# EAGLE design datalogger1 (EAGLE 7.4.0)
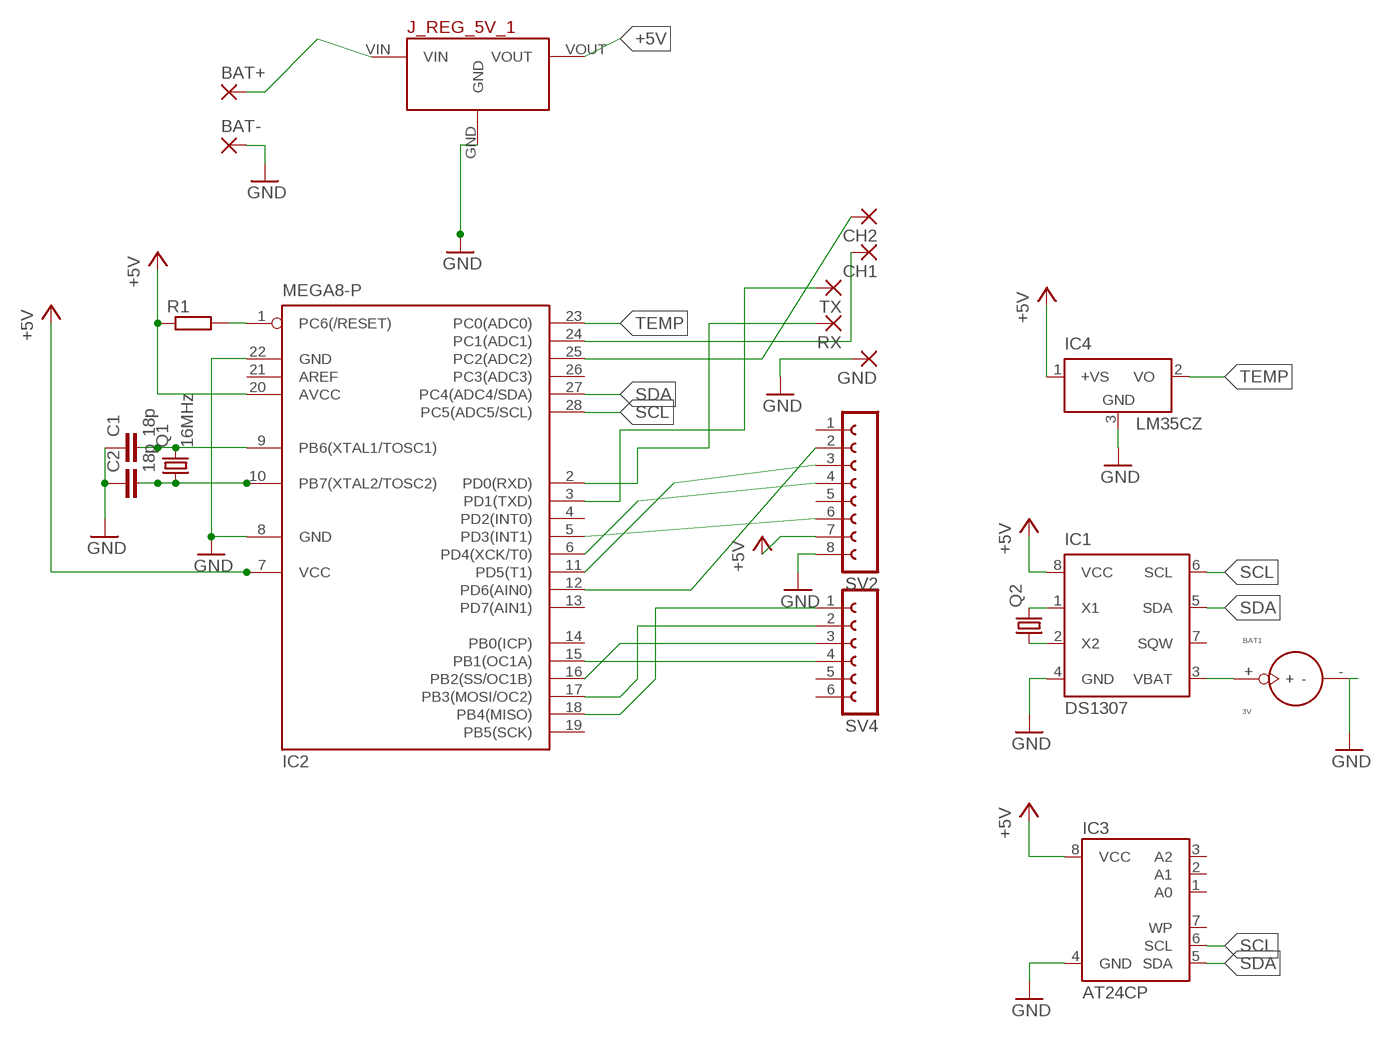
[diagram p0: schematic, sheet 1]

## Parts
BAT1  3V  BATTERY_1236_C  [BATTERY_1236_C]
BAT+  2,54/1,0  [2,54/1,0]
BAT-  2,54/1,0  [2,54/1,0]
C1  18p  C-EU050-024X044  [C050-024X044]
C2  18p  C-EU050-024X044  [C050-024X044]
CH1  1,6/0,8  [1,6/0,8]
CH2  1,6/0,8  [1,6/0,8]
GND  1,6/0,8  [1,6/0,8]
IC1  DS1307  [DIL08]
IC2  MEGA8-P  [DIL28-3]
IC3  AT24CP  [DIL08]
IC4  LM35CZ  [TO92]
J_REG_5V_1  5V_VOLTAGE_REGULATOR  [5V_VOLTAGE_REGULATOR]
Q1  16MHz  CRYSTALHC49S  [HC49/S]
Q2  CRYSTALTC38H  [TC38H]
R1  R-EU_0204/7  [0204/7]
RX  1,6/0,8  [1,6/0,8]
SV2  FE08-1  [FE08]
SV4  FE06-1  [FE06]
TX  1,6/0,8  [1,6/0,8]

## Nets
+5V: IC1.8(VCC) IC2.7(VCC) IC2.20(AVCC) IC3.8(VCC) IC4.1(+VS) J_REG_5V_1.VOUT R1.1 SV2.7
GND: BAT1.- BAT-.1(P) C1.1 C2.1 GND.1(P) IC1.4(GND) IC2.8(GND) IC2.22(GND) IC3.4(GND) IC4.3(GND) J_REG_5V_1.GND SV2.8
N$1: IC1.1(X1) Q2.2
N$2: IC1.2(X2) Q2.1
N$3: C1.2 IC2.9(PB6(XTAL1/TOSC1)) Q1.2
N$4: C2.2 IC2.10(PB7(XTAL2/TOSC2)) Q1.1
N$5: IC2.18(PB4(MISO)) SV4.1
N$6: IC2.17(PB3(MOSI/OC2)) SV4.2
N$7: BAT1.+ IC1.3(VBAT)
N$8: IC2.16(PB2(SS/OC1B)) SV4.3
N$9: IC2.15(PB1(OC1A)) SV4.4
N$10: IC2.12(PD6(AIN0)) SV2.2
N$11: IC2.11(PD5(T1)) SV2.3
N$12: IC2.6(PD4(XCK/T0)) SV2.4
N$13: IC2.5(PD3(INT1)) SV2.6
N$14: IC2.1(PC6(/RESET)) R1.2
N$15: IC2.2(PD0(RXD)) RX.1(P)
N$16: IC2.3(PD1(TXD)) TX.1(P)
N$17: CH1.1(P) IC2.24(PC1(ADC1))
N$18: BAT+.1(P) J_REG_5V_1.VIN
N$19: CH2.1(P) IC2.25(PC2(ADC2))
SCL: IC1.6(SCL) IC2.28(PC5(ADC5/SCL)) IC3.6(SCL)
SDA: IC1.5(SDA) IC2.27(PC4(ADC4/SDA)) IC3.5(SDA)
TEMP: IC2.23(PC0(ADC0)) IC4.2(VO)
Unconnected: IC1.7(SQW) IC2.4(PD2(INT0)) IC2.13(PD7(AIN1)) IC2.14(PB0(ICP)) IC2.19(PB5(SCK)) IC2.21(AREF) IC2.26(PC3(ADC3)) IC3.1(A0) IC3.2(A1) IC3.3(A2) IC3.7(WP) SV2.1 SV2.5 SV4.5 SV4.6

## Library data of the parts
BAT1 = Itead_BP_110825.lbr:BATTERY_1236_C: SOC004
BAT+ BAT- = wirepad:2,54/1,0: THROUGH-HOLE PAD
C1 C2 = resistor:C-EU: CAPACITOR, European symbol
CH1 CH2 GND RX TX = wirepad:1,6/0,8: THROUGH-HOLE PAD
IC1 = ds1307_pcf8583:DS1307: I2C-Bus CLOCK/CALENDAR
IC2 = atmel:MEGA8-P: MICROCONTROLLER 8 Kbytes FLASH, 1 kbytes SRAM, 512 bytes EEPROM, USART, 4-channel 10 bit ADC, 2-channel 8 bit ADC Pin compatible with Atmega48, ATMega88, ATMega168 Source: avr.lbr; OC_FARNELL: unknown; OC_NEWARK: unknown
IC3 = atmel:AT24C*: 2-wire serial EEPROM; MPN: AT24C1024BW-SH-B; OC_FARNELL: 1362646; OC_NEWARK: 03P2044
IC4 = lm35:LM35: Single-Supply Centigrade Temperature Sensor Vout = (10mV/°C x Temp °C) +5mmmV Source: http://www.national.com/ds/LM/LM35.pdf
J_REG_5V_1 = Pololu Voltage Regulators:5V_VOLTAGE_REGULATOR: Polulu 5V Step-Up/Step-Down Voltage REgulator S7V7F5
Q1 = crystal:CRYSTAL: CRYSTAL; OC_FARNELL: 1667008; OC_NEWARK: unknown
Q2 = crystal:CRYSTAL: CRYSTAL; OC_FARNELL: unknown; OC_NEWARK: unknown
R1 = resistor:R-EU_: RESISTOR, European symbol
SV2 = con-lsta:FE08-1: FEMALE HEADER; OC_FARNELL: unknown; OC_NEWARK: unknown
SV4 = con-lsta:FE06-1: FEMALE HEADER; OC_FARNELL: unknown; OC_NEWARK: unknown

## Board
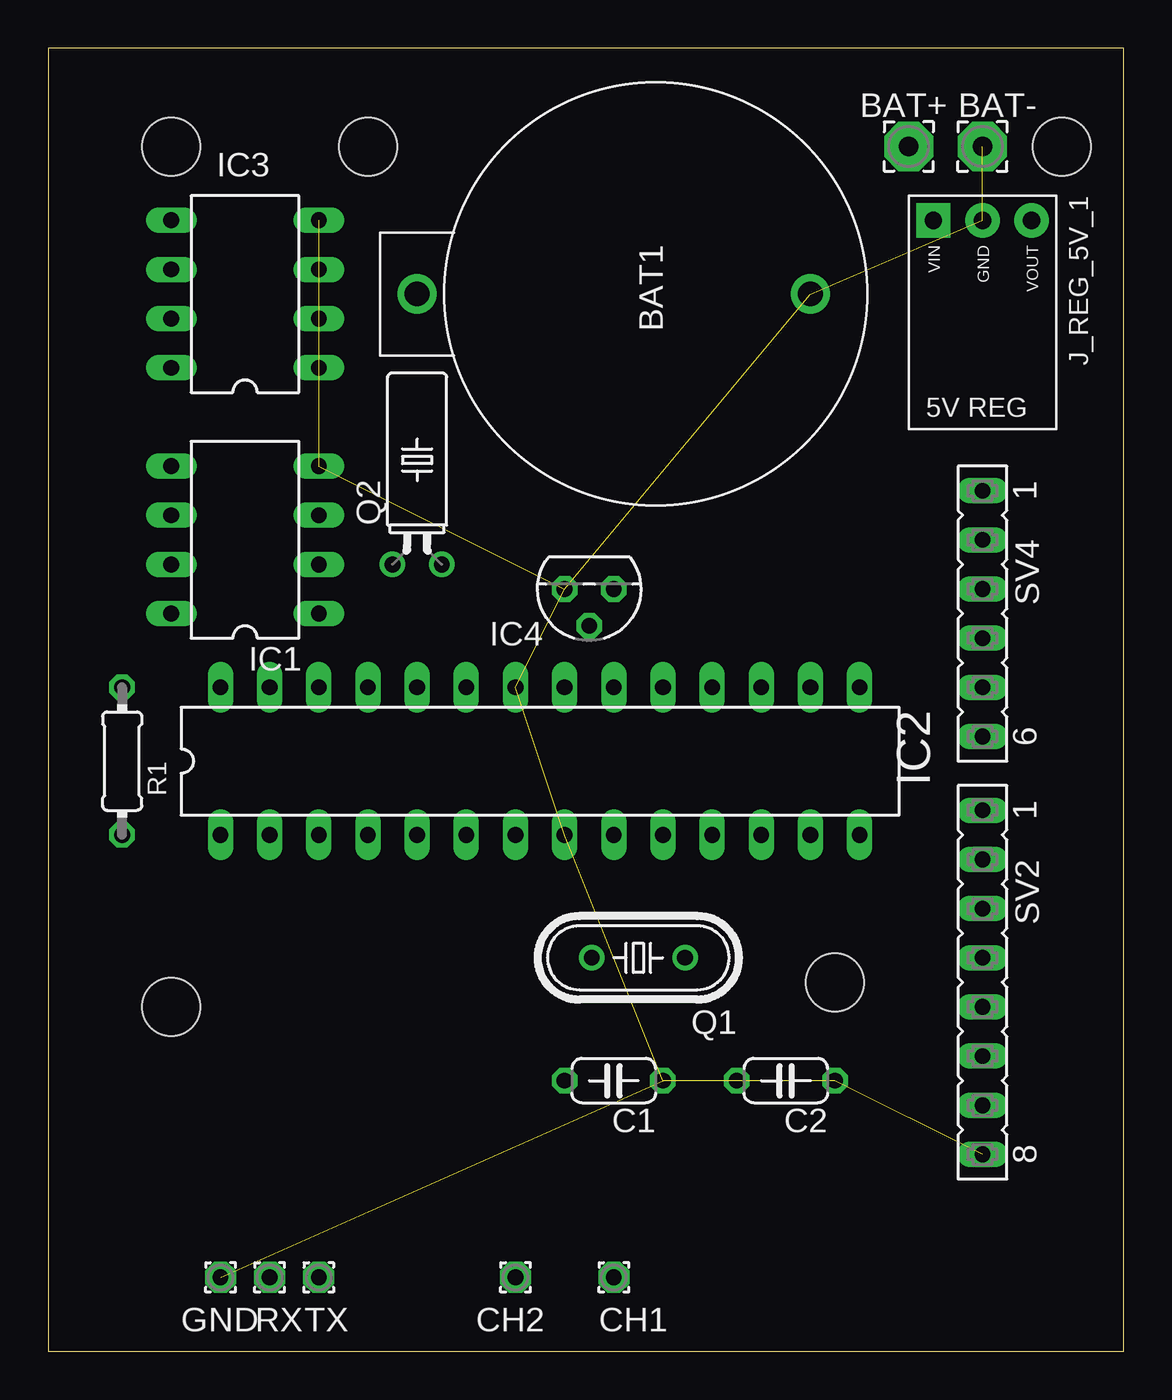
[diagram p1: board, top side]
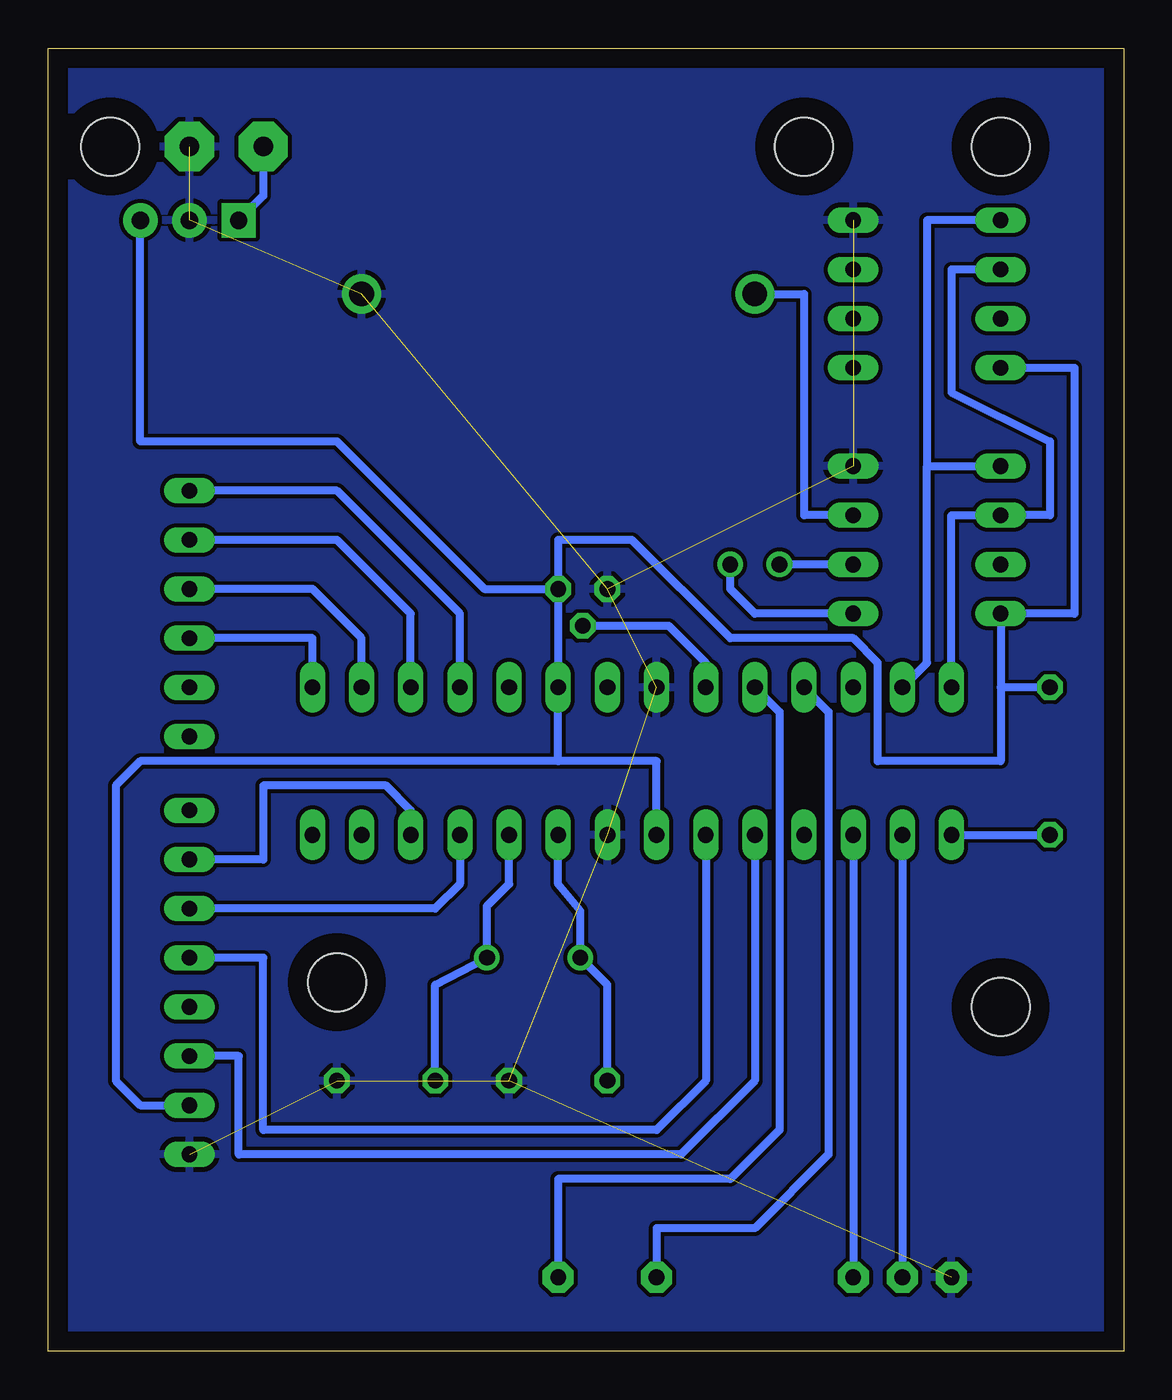
[diagram p2: board, bottom side, seen from below]

Size 55.55 x 67.3 mm. Coordinates in mm from the lower left corner, seen from the top.
Outline: 0,0 55.55,0 55.55,67.3 0,67.3 0,0
Copper layers (1*16): Top 0.035mm / dielectric 1.5mm / Bottom 0.035mm
Design rules "default": minimum track width 10mil, minimum drill 24mil, track to track 8mil, track to pad 8mil, pad to pad 8mil, via to via 8mil, smd to smd 8mil, copper to edge 40mil, drill to drill 8mil, minimum pad ring 10mil, minimum via ring 8mil, stop-mask expansion 4mil, vias tented up to drill 0mil, thermal gap 10mil
Holes 3 mm at 16.51,62.23 40.64,19.05 6.35,62.23 52.35,62.23 6.35,17.78

### Footprints (pad centres in the part's own frame; a part is rotated, then mirrored left to right if it is on the bottom)
BATTERY_1236_C = drill 1.27 pad 2.032: + 0,0; - 0,20.32
2,54/1,0 = drill 1.016 pad 2.54 octagon: 1 0,0
C050-024X044 = drill 0.813 octagon: 1 -2.54,0; 2 2.54,0
1,6/0,8 = drill 0.813 pad 1.6 octagon: 1 0,0
DIL08 = drill 0.813 long: 1 -3.81,-3.81; 2 -1.27,-3.81; 3 1.27,-3.81; 4 3.81,-3.81; 5 3.81,3.81; 6 1.27,3.81; 7 -1.27,3.81; 8 -3.81,3.81
DIL28-3 = drill 0.813 long: 1 -16.51,-3.81; 2 -13.97,-3.81; 3 -11.43,-3.81; 4 -8.89,-3.81; 5 -6.35,-3.81; 6 -3.81,-3.81; 7 -1.27,-3.81; 8 1.27,-3.81; 9 3.81,-3.81; 10 6.35,-3.81; 11 8.89,-3.81; 12 11.43,-3.81; 13 13.97,-3.81; 14 16.51,-3.81; 15 16.51,3.81; 16 13.97,3.81; 17 11.43,3.81; 18 8.89,3.81; 19 6.35,3.81; 20 3.81,3.81; 21 1.27,3.81; 22 -1.27,3.81; 23 -3.81,3.81; 24 -6.35,3.81; 25 -8.89,3.81; 26 -11.43,3.81; 27 -13.97,3.81; 28 -16.51,3.81
TO92 = drill 0.813 octagon: 1 -1.27,0; 2 0,1.905; 3 1.27,0
5V_VOLTAGE_REGULATOR = drill 0.9 pad 1.778: GND 0,-6.35; VOUT -2.54,-6.35 | drill 0.9 pad 1.778 square: VIN 2.54,-6.35
HC49/S = drill 0.813: 1 -2.413,0; 2 2.413,0
TC38H = drill 0.813: 1 -1.27,0; 2 1.27,0
0204/7 = drill 0.813 octagon: 1 -3.81,0; 2 3.81,0
FE08 = drill 0.813 long: 1 -8.89,0; 2 -6.35,0; 3 -3.81,0; 4 -1.27,0; 5 1.27,0; 6 3.81,0; 7 6.35,0; 8 8.89,0
FE06 = drill 0.813 long: 1 -6.35,0; 2 -3.81,0; 3 -1.27,0; 4 1.27,0; 5 3.81,0; 6 6.35,0

### Placement (x,y rotation side)
BAT1  19.05,54.61 270 top
BAT+  44.45,62.23 0 top
BAT-  48.26,62.23 0 top
C1  29.21,13.97 180 top
C2  38.1,13.97 180 top
CH1  29.21,3.81 0 top
CH2  24.13,3.81 0 top
GND  8.89,3.81 0 top
IC1  10.16,41.91 90 top
IC2  25.4,30.48 0 top
IC3  10.16,54.61 90 top
IC4  27.94,39.37 180 top
J_REG_5V_1  48.26,52.07 180 top
Q1  30.48,20.32 180 top
Q2  19.05,40.64 0 top
R1  3.81,30.48 270 top
RX  11.43,3.81 0 top
SV2  48.26,19.05 270 top
SV4  48.26,38.1 270 top
TX  13.97,3.81 0 top

### Tracks (layer width: path | path; a pad name or v marks a point on that pad's centre or on a via)
+5V
  Bottom 0.406: 6.35,34.29 IC1.8 2.54,38.1 2.54,50.8 IC3.8 | 29.21,30.48 24.13,30.48 IC2.7 | 29.21,30.48 IC2.20 IC4.1 | 6.35,34.29 6.35,30.48 12.7,30.48 12.7,35.56 13.97,36.83 20.32,36.83 25.4,41.91 29.21,41.91 IC4.1 | R1.1 6.35,34.29 | 29.21,30.48 50.8,30.48 52.07,29.21 52.07,13.97 50.8,12.7 SV2.7 | IC4.1 33.02,39.37 40.64,46.99 50.8,46.99 J_REG_5V_1.VOUT
GND  (11 unrouted)
  pour Bottom: -1.27,68.58 -1.27,-1.27 55.88,-1.27 55.88,68.58
N$1
  Bottom 0.406: IC1.1 19.05,38.1 20.32,39.37 Q2.2
N$2
  Bottom 0.406: IC1.2 Q2.1
N$3
  Bottom 0.406: IC2.9 29.21,24.13 28.07,22.73 Q1.2 26.67,18.92 C1.2
N$4
  Bottom 0.406: IC2.10 31.75,24.13 32.89,22.99 Q1.1 35.56,18.92 C2.2
N$5
  Bottom 0.406: IC2.18 34.29,38.1 40.64,44.45 SV4.1
N$6
  Bottom 0.406: IC2.17 36.83,38.1 40.64,41.91 SV4.2
N$7
  Bottom 0.406: IC1.3 16.51,43.18 16.51,54.61 BAT1.+
N$8
  Bottom 0.406: IC2.16 39.37,36.83 41.91,39.37 SV4.3
N$9
  Bottom 0.406: IC2.15 41.91,36.83 SV4.4
N$10
  Bottom 0.406: IC2.12 36.83,27.94 38.1,29.21 44.45,29.21 44.45,25.4 SV2.2
N$11
  Bottom 0.406: IC2.11 34.29,24.13 35.56,22.86 SV2.3
N$12
  Bottom 0.406: IC2.6 21.59,13.97 24.13,11.43 44.45,11.43 44.45,20.32 SV2.4
N$13
  Bottom 0.406: IC2.5 19.05,13.97 22.86,10.16 45.72,10.16 45.72,15.24 SV2.6
N$14
  Bottom 0.406: IC2.1 R1.2
N$15
  Bottom 0.406: IC2.2 RX.1
N$16
  Bottom 0.406: IC2.3 TX.1
N$17
  Bottom 0.406: IC2.24 17.78,33.02 17.78,11.43 20.32,8.89 29.21,8.89 CH1.1
N$18
  Bottom 0.406: BAT+.1 44.45,59.69 J_REG_5V_1.VIN
N$19
  Bottom 0.406: IC2.25 15.24,33.02 15.24,10.16 19.05,6.35 24.13,6.35 CH2.1
SCL
  Bottom 0.406: IC3.6 8.89,55.88 8.89,49.53 3.81,46.99 3.81,43.18 IC1.6 8.89,43.18 IC2.28
SDA
  Bottom 0.406: IC2.27 10.16,35.56 10.16,45.72 | 10.16,45.72 IC1.5 | IC3.5 10.16,58.42 10.16,45.72
TEMP
  Bottom 0.406: IC2.23 21.59,35.56 23.49,37.46 IC4.2